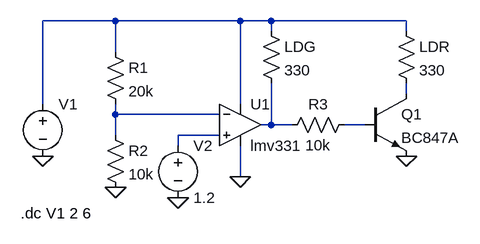
[diagram p0: schematic battery_selfcheck.asc]
battery_selfcheck.asc, the LTspice schematic file:
Version 4
SHEET 1 1028 680
WIRE 176 -16 64 -16
WIRE 368 -16 176 -16
WIRE 416 -16 368 -16
WIRE 624 -16 416 -16
WIRE 416 0 416 -16
WIRE 624 0 624 -16
WIRE 176 32 176 -16
WIRE 624 96 624 80
WIRE 64 112 64 -16
WIRE 368 112 368 -16
WIRE 176 128 176 112
WIRE 336 128 176 128
WIRE 416 144 416 80
WIRE 416 144 400 144
WIRE 448 144 416 144
WIRE 560 144 528 144
WIRE 176 160 176 128
WIRE 336 160 272 160
WIRE 272 176 272 160
WIRE 368 224 368 176
FLAG 272 256 0
FLAG 176 240 0
FLAG 64 192 0
FLAG 368 224 0
FLAG 624 192 0
SYMBOL SBORKA\\COMPARATOR\\lmv331 368 144 R0
SYMATTR InstName U1
SYMBOL res 160 16 R0
SYMATTR InstName R1
SYMATTR Value 20k
SYMBOL res 160 144 R0
SYMATTR InstName R2
SYMATTR Value 10k
SYMBOL res 400 -16 R0
SYMATTR InstName LDG
SYMATTR Value 330
SYMBOL npn 560 96 R0
SYMATTR InstName Q1
SYMATTR Value BC847A
SYMBOL res 608 -16 R0
SYMATTR InstName LDR
SYMATTR Value 330
SYMBOL voltage 64 96 R0
WINDOW 123 0 0 Left 0
WINDOW 39 0 0 Left 0
SYMATTR InstName V1
SYMATTR Value ""
SYMBOL voltage 272 160 R0
WINDOW 123 0 0 Left 0
WINDOW 39 0 0 Left 0
SYMATTR InstName V2
SYMATTR Value 1.2
SYMBOL res 544 128 R90
WINDOW 0 0 56 VBottom 2
WINDOW 3 32 56 VTop 2
SYMATTR InstName R3
SYMATTR Value 10k
TEXT 30 280 Left 2 !.dc V1 2 6

The netlist it stands for:
* battery_selfcheck.asc
* U1: lmv331 (symbol SBORKA\COMPARATOR\lmv331 not available, pins judged from their places): In+=N006 In-=N003 V+=N001 V-=0 OUT=N004
R1 N001 N003 20k
R2 N003 0 10k
R§LDG N001 N004 330
Q1 N002 N005 0 0 BC847A
R§LDR N001 N002 330
V1 N001 0
V2 N006 0 1.2
R3 N005 N004 10k
.model NPN NPN
.model PNP PNP
.lib standard.bjt
.dc V1 2 6
.backanno
.end